# Altium schematic sheet 010_Fan.SchDoc
size A4; Organization: OLTEST; Revision: 01; SheetNumber: 10; SheetTotal: 12; Название листа: Название листа; Разработчик: Бондарчук С.; Прибор: R100; АМАК.000000.000 Э3: R100.220.040.000 Э3; Дата: 23.01.2018; Формат: A4
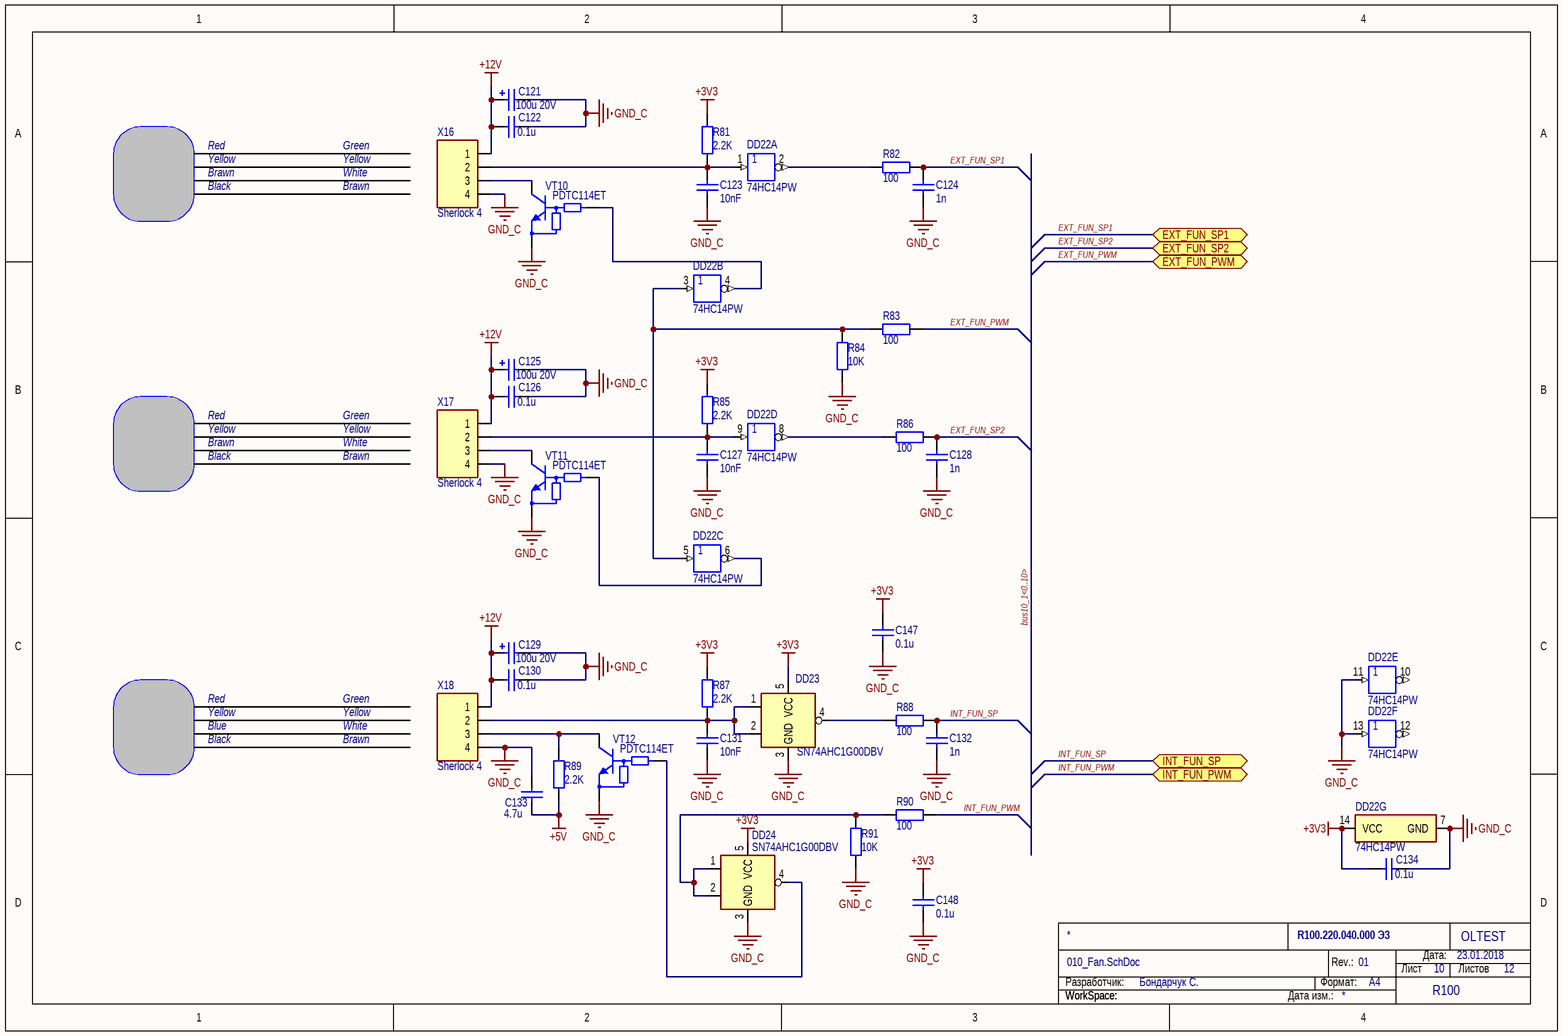
[diagram p0: 010_Fan.SchDoc]

## Parts
C121  100u 20V  [TAJD]
C122  0.1u  [SMD_C_0603]
C123  10nF  [SMD_C_0603]
C124  1n  [SMD_C_0603]
C125  100u 20V  [TAJD]
C126  0.1u  [SMD_C_0603]
C127  10nF  [SMD_C_0603]
C128  1n  [SMD_C_0603]
C129  100u 20V  [TAJD]
C130  0.1u  [SMD_C_0603]
C131  10nF  [SMD_C_0603]
C132  1n  [SMD_C_0603]
C133  4.7u  [SMD_C_0805]
C134  0.1u  [SMD_C_0603]
C147  0.1u  [SMD_C_0603]
C148  0.1u  [SMD_C_0603]
DD22  74HC14PW  [TSSOP14]  (parts A,B,C,D,E,F,G of 7)
DD23  SN74AHC1G00DBV  [SOT-23(DBV)]
DD24  SN74AHC1G00DBV  [SOT-23(DBV)]
R81  2.2K  [SMD_R_0603]
R82  100  [SMD_R_0603]
R83  100  [SMD_R_0603]
R84  10K  [SMD_R_0603]
R85  2.2K  [SMD_R_0603]
R86  100  [SMD_R_0603]
R87  2.2K  [SMD_R_0603]
R88  100  [SMD_R_0603]
R89  2.2K  [SMD_R_0603]
R90  100  [SMD_R_0603]
R91  10K  [SMD_R_0603]
VT10  PDTC114ET  [SOT23-3]
VT11  PDTC114ET  [SOT23-3]
VT12  PDTC114ET  [SOT23-3]
X16  Sherlock 4  [35362-0450]
X17  Sherlock 4  [35362-0450]
X18  Sherlock 4  [35362-0450]

## Ports
EXT_FUN_PWM, EXT_FUN_SP1, EXT_FUN_SP2, INT_FUN_PWM, INT_FUN_SP

## Nets
+3V3: C134.1 C147.2 C148.2 DD22.14(VCC) DD23.5(VCC) DD24.5(VCC) R81.2 R85.2 R87.2
+5V: C133.1 R89.1
+12V: C121.1 C122.1 C125.1 C126.1 C129.1 C130.1 X16.1 X17.1 X18.1
GND_C: C121.2 C122.2 C123.2 C124.1 C125.2 C126.2 C127.2 C128.1 C129.2 C130.2 C131.2 C132.1 C133.2 C134.2 C147.1 C148.1 DD22.7(GND) DD22.11(5A) DD22.13(6A) DD23.3(GND) DD24.3(GND) R84.1 R91.1 VT10.2(E) VT11.2(E) VT12.2(E) X16.4 X17.4 X18.4
EXT_FUN_PWM: R83.2 ; port EXT_FUN_PWM
EXT_FUN_SP1: C124.2 R82.2 ; port EXT_FUN_SP1
EXT_FUN_SP2: C128.2 R86.2 ; port EXT_FUN_SP2
INT_FUN_PWM: R90.2 ; port INT_FUN_PWM
INT_FUN_SP: C132.2 R88.2 ; port INT_FUN_SP
NetC123_1: C123.1 DD22.1(1A) R81.1 X16.2
NetC127_1: C127.1 DD22.9(4A) R85.1 X17.2
NetC131_1: C131.1 DD23.1 DD23.2 R87.1 X18.2
NetDD22_2: DD22.2(1Y) R82.1
NetDD22_3: DD22.3(2A) DD22.5(3A) R83.1 R84.2
NetDD22_4: DD22.4(2Y) VT10.1(B)
NetDD22_6: DD22.6(3Y) VT11.1(B)
NetDD22_8: DD22.8(4Y) R86.1
NetDD23_4: DD23.4 R88.1
NetDD24_1: DD24.1 DD24.2 R90.1 R91.2
NetDD24_4: DD24.4 VT12.1(B)
NetR89_2: R89.2 VT12.3(C) X18.3
NetVT10_3: VT10.3(C) X16.3
NetVT11_3: VT11.3(C) X17.3

Not connected (* = marked no-connect by the designer): DD22 10(5Y) 12(6Y)

## Buses and harness runs
bus bus10_1<0..10>

## Notes on the sheet
- Red
- Yellow
- Brawn
- Green
- White
- Black
- Blue
- Разработчик:
- Формат:
- Rev.:
- Лист
- Дата:
- Листов
- WorkSpace:
- Дата изм.:
- (in symbol SN74AHC1G00DBV) &

## Library data of the parts
C121 C125 C129 = TECAP 100u 20V 10%: SMD SIZE D TANTALUM AVX 20V 10%; PartNumber: TAJD107K020RNJ; Manufacturer: AVX; Value: 100u 20V
C122 C126 C130 C134 C147 C148 = C0603 0.1u 50V 10%: SMD C 0603 MURATA 50V 10% X7R; PartNumber: GRM188R71H104K; Manufacturer: MURATA; Value: 0.1u
C123 C127 C131 = C0603 10nF 100V 10%: SMD C 0603 MURATA 100V 10% X7R; PartNumber: GRJ188R72A103KE11#; Manufacturer: MURATA; Value: 10nF
C124 C128 C132 = C0603 1n 50V 5%: SMD C 0603 MURATA 50V 5% NP0; PartNumber: GRM1885C1H102JA01; Manufacturer: MURATA; Value: 1n
C133 = C0805 4.7u 25V 20%  X5R: SMD C 0805 MURATA 50V 5% NP0; PartNumber: GRM21BR61E475M; Manufacturer: MURATA; Value: 4.7u
DD22 = 74HC14: Quadruple 2-Input Positive-OR Gates, PW0014A; Manufacturer: Texas Instruments; PackageReference: PW0014A; PartNumber: 74HC14PW
DD23 DD24 = SN74AHC1G00DBV: 2-in NAND; Manufacturer: Texas Instruments; PartNumber: SN74AHC1G00DBV
R81 R85 R87 R89 = R0603 2.2K 1%: SMD R 0603 VISHAY 0.1W 75V 1% 100ppm; PartNumber: CRCW06032K20FK; Manufacturer: VISHAY; Value: 2.2K
R82 R83 R86 R88 R90 = R0603 100 1%: SMD R 0603 VISHAY 0.1W 75V 1% 100ppm; PartNumber: CRCW0603100RFK; Manufacturer: VISHAY; Value: 100
R84 R91 = R0603 10К 1%: SMD R 0603 VISHAY 0.1W 75V 1% 100ppm; PartNumber: CRCW060310K0FK; Manufacturer: VISHAY; Value: 10K
VT10-VT12 = PDTC114ET: Digital Transistor (BRT), R1=10 kOhm, R2=10 kOhm, NPN Transistor; Manufacturer: On Semiconductor; PartNumber: PDTC114ET
X16-X18 = 35362-0450: Sherlock 4 Top, 2A 125V 2mm; Manufacturer: MOLEX; PartNumber: 35362-0450